# EasyEDA Pro project Project.epro

# Schematic Schematic
Board Name: BOARD; Create Date: 2025-07-29; Page Name: Page 1; Project Name: ICM-20948 Pico; Schematic Name: Schematic; Update Date: 2025-08-12; Company: Astralis; Page Size: A4; Version: v2.5
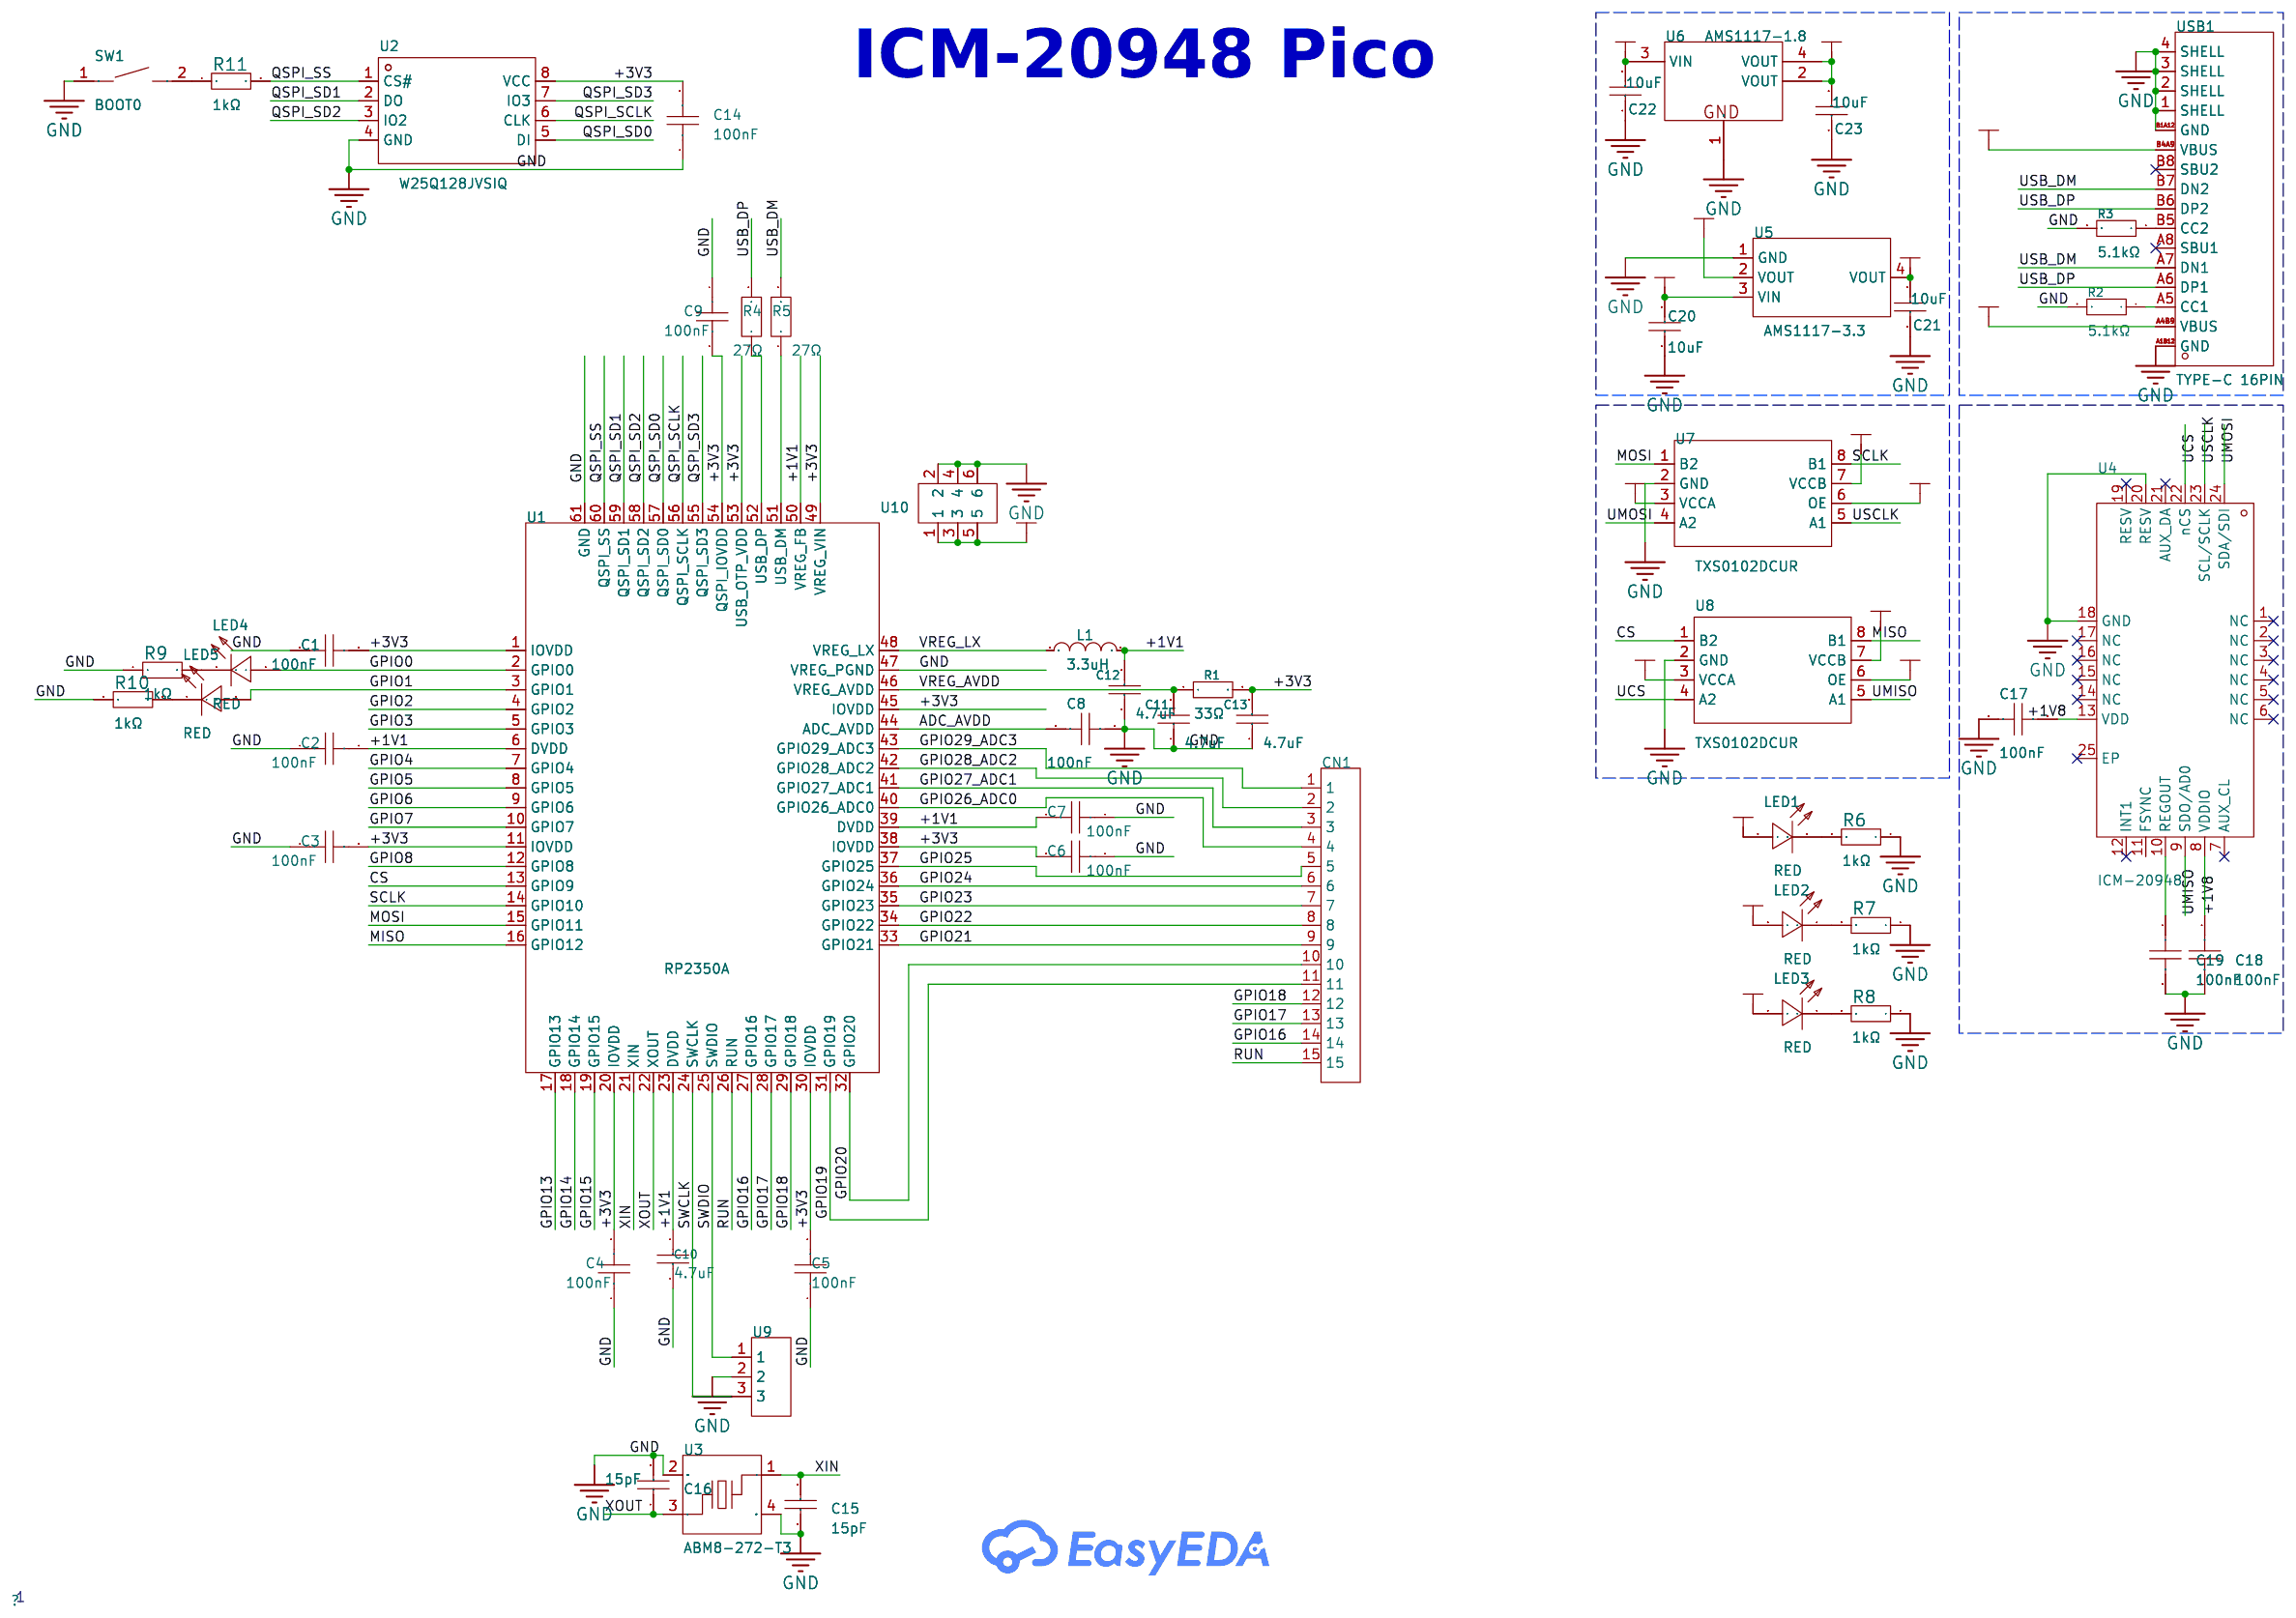
[diagram p0: schematic sheet]

## Parts
C1  100nF  [C0402]
C2  100nF  [C0402]
C3  100nF  [C0402]
C4  100nF  [C0402]
C5  100nF  [C0402]
C6  100nF  [C0402]
C7  100nF  [C0402]
C8  100nF  [C0402]
C9  100nF  [C0402]
C10  4.7uF  [C0402]
C11  4.7uF  [C0402]
C12  4.7uF  [C0402]
C13  4.7uF  [C0402]
C14  100nF  [C0402]
C15  15pF  [C0402]
C16  15pF  [C0402]
C17  100nF  [C0402]
C18  100nF  [C0402]
C19  100nF  [C0402]
C20  10uF  [C0402]
C21  10uF  [C0402]
C22  10uF  [C0402]
C23  10uF  [C0402]
CN1  排母插针1X15P  [CONN-TH_15P-L38.5-W2.4-P2.54]
L1  3.3uH  [IND-SMD_L2.0-W1.6_AOTA-B201610S3R3-101-T]
LED1  RED  [LED0603-RD]
LED2  RED  [LED0603-RD]
LED3  RED  [LED0603-RD]
LED4  RED  [LED0603-RD]
LED5  RED  [LED0603-RD]
R1  33Ω  [R0402]
R2  5.1kΩ  [R0402]
R3  5.1kΩ  [R0402]
R4  27Ω  [R0402]
R5  27Ω  [R0402]
R6  1kΩ  [R0402]
R7  1kΩ  [R0402]
R8  1kΩ  [R0402]
R9  1kΩ  [R0402]
R10  1kΩ  [R0402]
R11  1kΩ  [R0402]
SW1  BOOT0  [SW-SMD_L3.9-W3.0-P4.45]
U1  RP2350A  [QFN-60_L7.0-W7.0-P0.40-TL-EP3.4]
U2  W25Q128JVSIQ  [SOIC-8_L5.3-W5.3-P1.27-LS8.0-BL]
U3  ABM8-272-T3  [CRYSTAL-SMD_4P-L3.2-W2.5-BL]
U4  ICM-20948  [QFN-24_L3.0-W3.0-P0.40-BL-EP]
U5  AMS1117-3.3  [SOT-223-3_L6.5-W3.4-P2.30-LS7.0-BR]
U6  AMS1117-1.8  [SOT-223-4_L6.5-W3.5-P2.30-LS7.0-BR]
U7  TXS0102DCUR  [VSON8_L2.0-W2.3-P0.50-LS3.1-BL]
U8  TXS0102DCUR  [VSON8_L2.0-W2.3-P0.50-LS3.1-BL]
U9  HB-PH3-25413PB2GOP  [HDR-TH_3P-P2.54-V-M]  (no BOM)
U10  ZX-PZ2.54-2-3PZZ  [HDR-TH_6P-P2.54-V-M-R2-C3-S2.54-1]  (no BOM)
USB1  TYPE-C 16PIN  [USB-C-SMD_TYPE-C16PIN]  (no BOM)

## Library data of the parts
C1-C9 C14 C17-C19 = CL05B104KO5NNNC: Capacitance: Tolerance:±10% Tolerance:±10% Voltage Rated: Temperature Coefficient:; LCSC Part Name: 100nF ±10% 16V; Supplier Part: C1525; Manufacturer: SAMSUNG(三星); Supplier Footprint: 0402; Datasheet: https://atta.szlcsc.com/upload/public/pdf/source/20160218/1457707763339.pdf; Supplier: LCSC; Tolerance: ±10%
C10-C13 = CL05A475MP5NRNC: Capacitance: Tolerance:±20% Tolerance:±20% Voltage Rated: Temperature Coefficient:; LCSC Part Name: 4.7uF ±20% 10V; Supplier Part: C23733; Manufacturer: SAMSUNG(三星); Supplier Footprint: 0402; JLCPCB Part Class: Basic Part; Datasheet: https://atta.szlcsc.com/upload/public/pdf/source/20160218/1457707763339.pdf; Supplier: LCSC; Tolerance: ±20%
C15 C16 = 0402CG150J500NT: Capacitance: Tolerance:±5% Tolerance:±5% Voltage Rated: Temperature Coefficient:; LCSC Part Name: 15pF ±5% 50V; Supplier Part: C1548; Manufacturer: FH(风华); Supplier Footprint: 0402; JLCPCB Part Class: Basic Part; Datasheet: https://atta.szlcsc.com/upload/public/pdf/source/20200305/C486355_26A10D38EF8C2A5C37091D0039909270.pdf; Supplier: LCSC; Tolerance: ±5%
C20-C23 = CL05A106MQ5NUNC: Capacitance: Tolerance:±20% Tolerance:±20% Voltage Rated: Temperature Coefficient:; LCSC Part Name: 10uF ±20% 6.3V; Supplier Part: C15525; Manufacturer: SAMSUNG(三星); Supplier Footprint: 0402; JLCPCB Part Class: Basic Part; Datasheet: https://atta.szlcsc.com/upload/public/pdf/source/20220823/2B02EE04F8F211D38A52DCB16EB6BEBA.pdf; Supplier: LCSC; Tolerance: ±20%
CN1 = 排母插针1X15P: Supplier Part: C9900003275; Supplier Footprint: TH-15P; JLCPCB Part Class: Extended Part; Supplier: LCSC
L1 = AOTA-B201610S3R3-101-T: Supplier Part: C42411119; Manufacturer: ABRACON; Supplier Footprint: 0806; JLCPCB Part Class: Extended Part; Datasheet: https://atta.szlcsc.com/upload/public/pdf/source/20241210/8ED7235334351200B2CE75E3CBC0DAAD.pdf; Supplier: LCSC
LED1-LED5 = KT-0603R: Emitted Color:Red Power Dissipation:- Forward Current:- Dominant Wavelength:- Dominant Wavelength:- Peak Wavelength:- Diode Configuration:- Lens Color:- Color Temperature:- Color Temperature:- Viewing Angle:- Mounting Sytle:- Operating Temperature:-40℃~+8; LCSC Part Name: 0603 红灯 高亮; Supplier Part: C2286; Manufacturer: KENTO; Supplier Footprint: 0603; JLCPCB Part Class: Basic Part; Datasheet: https://atta.szlcsc.com/upload/public/pdf/source/20160616/1466072038404.pdf; Supplier: LCSC; Emitted Color: Red; Operating Temperature: -40℃~+85℃
R1 = 0402WGF330JTCE: Type:Thick Film Resistors Resistance:33Ω Tolerance:±1% Tolerance:±1% Power(Watts): Overload Voltage (Max): Temperature Coefficient:±100ppm/℃ Temperature Coefficient:±100ppm/℃ Operating Temperature Range:-55℃~+155℃ Operating Temperature Range:-55℃~+155℃; LCSC Part Name: 33Ω ±1% 62.5mW 厚膜电阻; Supplier Part: C25105; Manufacturer: UNI-ROYAL(厚声); Supplier Footprint: 0402; Datasheet: https://atta.szlcsc.com/upload/public/pdf/source/20200306/C422600_1E6D84923E4A46A82E41ADD87F860B5C.pdf; Supplier: LCSC; Type: Thick Film Resistors; Tolerance: ±1%; Temperature Coefficient: ±100ppm/℃; Operating Temperature Range: -55℃~+155℃
R2 R3 = 0402WGF5101TCE: Type:Thick Film Resistor Resistance:5.1kΩ Tolerance:±1% Tolerance:±1% Power(Watts):62.5mW Voltage-Supply(Max):50V Temperature Coefficient:±100ppm/℃ Temperature Coefficient:±100ppm/℃ Operating Temperature:-55℃~+155℃ Operating Temperature:-55℃~+155℃; LCSC Part Name: 5.1kΩ ±1% 62.5mW 厚膜电阻; Supplier Part: C25905; Manufacturer: UNI-ROYAL(厚声); Supplier Footprint: 0402; JLCPCB Part Class: Basic Part; Datasheet: https://atta.szlcsc.com/upload/public/pdf/source/20200306/C422600_1E6D84923E4A46A82E41ADD87F860B5C.pdf; Supplier: LCSC; Type: Thick Film Resistor; Tolerance: ±1%; Power(Watts): 62.5mW; Voltage-Supply(Max): 50V; Temperature Coefficient: ±100ppm/℃; Operating Temperature: -55℃~+155℃
R4 R5 = WR04X270JTL_C384351: Type:Thick Film Resistor Resistance:27Ω Tolerance:±5% Tolerance:±5% Power(Watts):62.5mW Voltage-Supply(Max):50V Temperature Coefficient:±100ppm/℃ Temperature Coefficient:±100ppm/℃ Operating Temperature:-55℃~+155℃ Operating Temperature:-55℃~+155℃; LCSC Part Name: 厚膜电阻 27Ω ±5% 62.5mW; Supplier Part: C384351; Manufacturer: Walsin(华新科); Manufacturer Part: WR04X270JTL; Supplier Footprint: 0402; JLCPCB Part Class: Extended Part; Datasheet: https://atta.szlcsc.com/upload/public/pdf/source/20191217/C470037_D99261402F77DA8B1D609223749D445A.pdf; Supplier: LCSC; Type: Thick Film Resistor; Tolerance: ±5%; Power(Watts): 62.5mW; Voltage-Supply(Max): 50V; Temperature Coefficient: ±100ppm/℃; Operating Temperature: -55℃~+155℃
R6-R11 = 0402WGF1001TCE: Type:Thick Film Resistors Resistance:1kΩ Tolerance:±1% Tolerance:±1% Power(Watts): Overload Voltage (Max): Temperature Coefficient:±100ppm/℃ Temperature Coefficient:±100ppm/℃ Operating Temperature Range:-55℃~+155℃ Operating Temperature Range:-55℃~+155℃; LCSC Part Name: 1kΩ ±1% 62.5mW 厚膜电阻; Supplier Part: C11702; Manufacturer: UNI-ROYAL(厚声); Supplier Footprint: 0402; JLCPCB Part Class: Basic Part; Datasheet: https://atta.szlcsc.com/upload/public/pdf/source/20200306/C422600_1E6D84923E4A46A82E41ADD87F860B5C.pdf; Supplier: LCSC; Type: Thick Film Resistors; Tolerance: ±1%; Temperature Coefficient: ±100ppm/℃; Operating Temperature Range: -55℃~+155℃
SW1 = TS-1088-AR02016: Circuit:SPST Actuator Style:Round Button Operating Force:160gf Mounting Style:Brick nogging Switch Length:4mm Switch Width:3mm Switch Height:2mm Strike Gundam:不带 Contact Current:50mA Voltage Rating (DC):12V Insulation Resistance:100MΩ Actuator/Cap Color:B; LCSC Part Name: 4*3*2mm 立贴 轻触开关; Supplier Part: C720477; Manufacturer: XUNPU(讯普); Supplier Footprint: SMD; Datasheet: https://atta.szlcsc.com/upload/public/pdf/source/20200810/C720475_60D09DD6C54279ADDB2DC25100F1CC11.pdf; Supplier: LCSC; Circuit: SPST; Actuator Style: Round Button; Operating Force: 160gf; Mounting Style: Brick nogging; Switch Length: 4mm; Switch Width: 3mm; Switch Height: 2mm; Strike Gundam: 不带; Contact Current: 50mA; Voltage Rating (DC): 12V; Insulation Resistance: 100MΩ; Actuator/Cap Color: Black; Pin Style: SMDSplicing; Mechanical Life: 10万次; Operating Temperature: -30℃~+80℃
U1 = RP2350A_C42411118: LCSC Part Name: 微控制器; Supplier Part: C42411118; Manufacturer: Raspberry Pi(树莓派); Supplier Footprint: QFN-60-EP(7x7); JLCPCB Part Class: Extended Part; Datasheet: https://item.szlcsc.com/datasheet/RP2350A/44392931.html; Supplier: LCSC
U2 = W25Q128JVSIQ: Interface Type:SPI Memory Size:128Mbit Clock Frequency (fc):133MHz Supply Voltage:2.7V~3.6V Supply Voltage:2.7V~3.6V Page Programming Time (Tpp):700us Block Erase Time (tBE):120ms@(32KB) Data Retention - TDR (Year):20 years Operating Temperature:-40℃~+85℃; LCSC Part Name: W25Q128JVSIQ 编带; Supplier Part: C97521; Manufacturer: WINBOND(华邦); Supplier Footprint: SOIC-8-208mil; JLCPCB Part Class: Basic Part; Datasheet: https://atta.szlcsc.com/upload/public/pdf/source/20170316/1489627409956.pdf; Supplier: LCSC; Interface Type: SPI; Memory Size: 128Mbit; Clock Frequency (fc): 133MHz; Supply Voltage: 2.7V~3.6V; Page Programming Time (Tpp): 700us; Block Erase Time (tBE): 120ms@(32KB); Data Retention - TDR (Year): 20 years; Operating Temperature: -40℃~+85℃
U3 = ABM8-272-T3_C20625731: Supplier Part: C20625731; Manufacturer: ABRACON; Supplier Footprint: SMD3225-4P; JLCPCB Part Class: Extended Part; Datasheet: https://atta.szlcsc.com/upload/public/pdf/source/20240227/A8BE43F636D80F75C9AF5C59EDF21E9A.pdf; Supplier: LCSC
U4 = ICM-20948: Sensor Type:Accelerometer Gyroscope Operating Temperature:-40℃~+85℃ Operating Temperature:-40℃~+85℃; Supplier Part: C726001; Manufacturer: TDK InvenSense(应美盛); Supplier Footprint: QFN-24(3x3); JLCPCB Part Class: Extended Part; Datasheet: https://atta.szlcsc.com/upload/public/pdf/source/20210715/C726001_EFE09342631EBC06FA98BEAE6CEEEE9D.pdf; Supplier: LCSC; Sensor Type: Accelerometer Gyroscope; Operating Temperature: -40℃~+85℃
U5 = AMS1117-3.3_C6186: Output Type:Fixed Voltage - Supply:16V Output Voltage:3.3V Output Voltage:3.3V Output Current:1A Power Supply Rejection Ratio (PSRR):72dB@(120Hz) Voltage Dropout:1.1V@(800mA) standby current:5mA Noise:- Features:Over Current Protection；Over Temperature Pr; LCSC Part Name: 输出3.3V 1A; Supplier Part: C6186; Manufacturer: AMS; Supplier Footprint: SOT-223; Datasheet: https://item.szlcsc.com/datasheet/AMS1117-3.3/6652.html; Supplier: LCSC; Output Type: Fixed; Voltage - Supply: 16V; Output Voltage: 3.3V; Output Current: 1A; Power Supply Rejection Ratio (PSRR): 72dB@(120Hz); Voltage Dropout: 1.1V@(800mA); standby current: 5mA; Features: Over Current Protection；Over Temperature Protection; Operating Temperature: -40℃~+125℃; Output Configuration: Positive; Number of Outputs: 1
U6 = AMS1117-1.8: Output Type:Fixed Voltage - Supply:12V Output Voltage:1.8V Output Voltage:1.8V Output Current:1A Power Supply Rejection Ratio (PSRR):70dB@(120Hz) Voltage Dropout:1.4V@(1A) standby current:10mA Noise:- Features:Thermal Shutdown；Over Temperature Protection; LCSC Part Name: 输入18V 输出1.8V 1A; Supplier Part: C351432; Manufacturer: PUOLOP(迪浦); Supplier Footprint: SOT-223-4; JLCPCB Part Class: Extended Part; Datasheet: https://atta.szlcsc.com/upload/public/pdf/source/20240730/7181C1A6BD6A2E87EB4FF6312646ECA7.pdf; Supplier: LCSC; Output Type: Fixed; Voltage - Supply: 12V; Output Voltage: 1.8V; Output Current: 1A; Power Supply Rejection Ratio (PSRR): 70dB@(120Hz); Voltage Dropout: 1.4V@(1A); standby current: 10mA; Features: Thermal Shutdown；Over Temperature Protection; Operating Temperature: -40℃~+125℃@(Tj); Output Configuration: Positive; Number of Outputs: 1
U7 U8 = TXS0102DCUR: Channel Type:Bidirectional Input Signal:- Output Signal:- Data Rate:24Mbps Supply Voltage (VCCA):1.65V~3.6V Supply Voltage (VCCA):1.65V~3.6V Supply Voltage (VCCB):2.3V~5.5V Supply Voltage (VCCB):2.3V~5.5V Number of Circuits:1 Channels per Circuit:2 Output; LCSC Part Name: 24Mbps 2位双向电平转换器; Supplier Part: C53434; Manufacturer: TI(德州仪器); Supplier Footprint: VSSOP-8; JLCPCB Part Class: Extended Part; Datasheet: https://www.ti.com/cn/lit/gpn/txs0102; Supplier: LCSC; Channel Type: Bidirectional; Data Rate: 24Mbps; Supply Voltage (VCCA): 1.65V~3.6V; Supply Voltage (VCCB): 2.3V~5.5V; Number of Circuits: 1; Channels per Circuit: 2; Output Type: Open circuit leakage；Push-pull type; Operating Temperature: -40℃~+85℃; Features: Automatic Direction Detection; Voltage - Supply(VCCA): 1.65V~3.6V; Voltage - Supply(VCCB): 2.3V~5.5V
U9 = HB-PH3-25413PB2GOP: Pin Structure:1x3P Pitch:2.54mm Row Spacing:2.54mm Circluar Pins/Square Pins:Policy Mounting Type:Straight Number of Rows:Single Row Number of Pins:3P Current Rating:3A Voltage Rating (Max):250V Length of Mating Pin:6mm Insulation Height:2.54mm Length of; LCSC Part Name: 1x3P 间距:2.54mm 方针 直插; Supplier Part: C6332196; Manufacturer: HANBO(汉博); Supplier Footprint: 插件,P=2.54mm; Datasheet: https://atta.szlcsc.com/upload/public/pdf/source/20230803/F72D259687963761DF1B552F3BB84A31.pdf; Supplier: LCSC; Pin Structure: 1x3P; Pitch: 2.54mm; Row Spacing: 2.54mm; Circluar Pins/Square Pins: Policy; Mounting Type: Straight; Number of Rows: Single Row; Number of Pins: 3P; Current Rating: 3A; Voltage Rating (Max): 250V; Length of Mating Pin: 6mm; Insulation Height: 2.54mm; Length of End Connection Pin: 3mm; Contact Material: Brass; Contact Plating: Gold; Operating Temperature: -40℃~+105℃; Color: Black
U10 = ZX-PZ2.54-2-3PZZ: Pin Structure:2x3P Pitch:2.54mm Row Spacing:2.54mm Circluar Pins/Square Pins:Policy Mounting Type:Straight Number of Rows:Double Row Number of Pins:6P Current Rating:3A Voltage Rating (Max):1kV Length of Mating Pin:6mm Insulation Height:2.5mm Length of En; LCSC Part Name: 2x3P 间距:2.54mm 方针 直插; Supplier Part: C7501274; Manufacturer: Megastar(兆星); Supplier Footprint: 插件,P=2.54mm; JLCPCB Part Class: Extended Part; Datasheet: https://atta.szlcsc.com/upload/public/pdf/source/20231122/E8390501A702A71E626C593F036B3607.pdf; Supplier: LCSC; Pin Structure: 2x3P; Pitch: 2.54mm; Row Spacing: 2.54mm; Circluar Pins/Square Pins: Policy; Mounting Type: Straight; Number of Rows: Double Row; Number of Pins: 6P; Current Rating: 3A; Voltage Rating (Max): 1kV; Length of Mating Pin: 6mm; Insulation Height: 2.5mm; Length of End Connection Pin: 3mm; Contact Material: Brass; Contact Plating: Gold; Operating Temperature: -40℃~+105℃; Color: Black
USB1 = TYPE-C16PIN: Connector Type:Type-C Protocol Standard:USB 3.1 Gender:Female Mounting Type:Surface Mount, Right Angle Number of Contacts:16P Number of Ports:1 Current Rating-Power:3A Voltage Rating:30V Connect-Disconnect Life:10,000 Cycles Detection color:Black Operatin; LCSC Part Name: Type-C 母 卧贴; Supplier Part: C393939; Manufacturer: SHOU HAN(首韩); Supplier Footprint: SMD; JLCPCB Part Class: Extended Part; Datasheet: https://atta.szlcsc.com/upload/public/pdf/source/20250618/9FBF2A26CFCE0E69298FA0B726710E9E.pdf; Supplier: LCSC; Connector Type: Type-C; Protocol Standard: USB 3.1; Gender: Female; Mounting Type: Surface Mount, Right Angle; Number of Contacts: 16P; Number of Ports: 1; Current Rating-Power: 3A; Voltage Rating: 30V; Connect-Disconnect Life: 10,000 Cycles; Detection color: Black; Operating Temperature: -40℃~+85℃

## Nets
+1V1: C2.2 C7.2 C10.2 C12.2 L1.2 U1.6(DVDD) U1.23(DVDD) U1.39(DVDD) U1.50(VREG_FB)
+1V8: C17.2 C18.1 C23.2 LED3.2(A) U4.8(VDDIO) U4.13(VDD) U6.2(VOUT) U6.4(VOUT) U7.3(VCCA) U7.6(OE) U8.3(VCCA) U8.6(OE)
+3V3: C1.2 C3.2 C4.2 C5.2 C6.2 C9.2 C13.2 C14.2 C21.2 LED2.2(A) R1.2 U1.1(IOVDD) U1.11(IOVDD) U1.20(IOVDD) U1.30(IOVDD) U1.38(IOVDD) U1.45(IOVDD) U1.49(VREG_VIN) U1.53(USB_OTP_VDD) U1.54(QSPI_IOVDD) U2.8(VCC) U5.2(VOUT) U5.4(VOUT) U7.7(VCCB) U8.7(VCCB) U10.1 U10.3 U10.5
GND: C1.1 C2.1 C3.1 C4.1 C5.1 C6.1 C7.1 C8.1 C9.1 C10.1 C11.1 C12.1 C13.1 C14.1 C15.1 C16.2 C17.1 C18.2 C19.2 C20.1 C21.1 C22.1 C23.1 R2.2 R3.2 R6.1 R7.1 R8.1 R9.1 R10.1 SW1.1 U1.47(VREG_PGND) U1.61(GND) U2.4(GND) U3.2(GND) U3.4(GND) U4.18(GND) U4.20(RESV) U5.1(GND) U6.1(GND) U7.2(GND) U8.2(GND) U9.2 U10.2 U10.4 U10.6 USB1.1(SHELL) USB1.2(SHELL) USB1.3(SHELL) USB1.4(SHELL) USB1.A1B12(GND) USB1.B1A12(GND)
VBUS: C20.2 C22.2 LED1.2(A) U5.3(VIN) U6.3(VIN) USB1.A4B9(VBUS) USB1.B4A9(VBUS)
ADC_AVDD: C8.2 U1.44(ADC_AVDD)
CS: U1.13(GPIO9) U8.1(B2)
GPIO0: LED4.2(A) U1.2(GPIO0)
GPIO1: LED5.2(A) U1.3(GPIO1)
GPIO2: U1.4(GPIO2)
GPIO3: U1.5(GPIO3)
GPIO4: U1.7(GPIO4)
GPIO5: U1.8(GPIO5)
GPIO6: U1.9(GPIO6)
GPIO7: U1.10(GPIO7)
GPIO8: U1.12(GPIO8)
GPIO13: U1.17(GPIO13)
GPIO14: U1.18(GPIO14)
GPIO15: U1.19(GPIO15)
GPIO16: CN1.14 U1.27(GPIO16)
GPIO17: CN1.13 U1.28(GPIO17)
GPIO18: CN1.12 U1.29(GPIO18)
GPIO19: CN1.11 U1.31(GPIO19)
GPIO20: CN1.10 U1.32(GPIO20)
GPIO21: CN1.9 U1.33(GPIO21)
GPIO22: CN1.8 U1.34(GPIO22)
GPIO23: CN1.7 U1.35(GPIO23)
GPIO24: CN1.6 U1.36(GPIO24)
GPIO25: CN1.5 U1.37(GPIO25)
GPIO26_ADC0: CN1.4 U1.40(GPIO26_ADC0)
GPIO27_ADC1: CN1.3 U1.41(GPIO27_ADC1)
GPIO28_ADC2: CN1.2 U1.42(GPIO28_ADC2)
GPIO29_ADC3: CN1.1 U1.43(GPIO29_ADC3)
MISO: U1.16(GPIO12) U8.8(B1)
MOSI: U1.15(GPIO11) U7.1(B2)
QSPI_SCLK: U1.56(QSPI_SCLK) U2.6(CLK)
QSPI_SD0: U1.57(QSPI_SD0) U2.5(DI)
QSPI_SD1: U1.59(QSPI_SD1) U2.2(DO)
QSPI_SD2: U1.58(QSPI_SD2) U2.3(IO2)
QSPI_SD3: U1.55(QSPI_SD3) U2.7(IO3)
QSPI_SS: R11.2 U1.60(QSPI_SS) U2.1(CS#)
RUN: CN1.15 U1.26(RUN)
SCLK: U1.14(GPIO10) U7.8(B1)
SWCLK: U1.24(SWCLK) U9.3
SWDIO: U1.25(SWDIO) U9.1
UCS: U4.22(nCS) U8.4(A2)
UMISO: U4.9(SDO/AD0) U8.5(A1)
UMOSI: U4.24(SDA/SDI) U7.4(A2)
USB_DM: R5.2 USB1.A7(DN1) USB1.B7(DN2)
USB_DP: R4.2 USB1.A6(DP1) USB1.B6(DP2)
USCLK: U4.23(SCL/SCLK) U7.5(A1)
VREG_AVDD: C11.2 R1.1 U1.46(VREG_AVDD)
VREG_LX: L1.1 U1.48(VREG_LX)
XIN: C15.2 U1.21(XIN) U3.1
XOUT: C16.1 U1.22(XOUT) U3.3
$1N10163: R5.1 U1.51(USB_DM)
$1N10164: R4.1 U1.52(USB_DP)
$1N10214: R2.1 USB1.A5(CC1)
$1N10215: R3.1 USB1.B5(CC2)
$1N10260: C19.1 U4.10(REGOUT)
$1N10297: LED1.1(K) R6.2
$1N10303: LED2.1(K) R7.2
$1N10309: LED3.1(K) R8.2
$1N12330: LED4.1(K) R9.2
$1N12589: LED5.1(K) R10.2
$1N12752: R11.1 SW1.2

Not connected (* = marked no-connect by the designer): U4 1(NC)* 2(NC)* 3(NC)* 4(NC)* 5(NC)* 6(NC)* 7(AUX_CL)* 11(FSYNC) 12(INT1)* 14(NC)* 15(NC)* 16(NC)* 17(NC)* 19(RESV)* 21(AUX_DA)* 25(EP)*; USB1 A8(SBU1)* B8(SBU2)*

## Notes on the sheet
- ICM-20948 Pico

# Board PCB
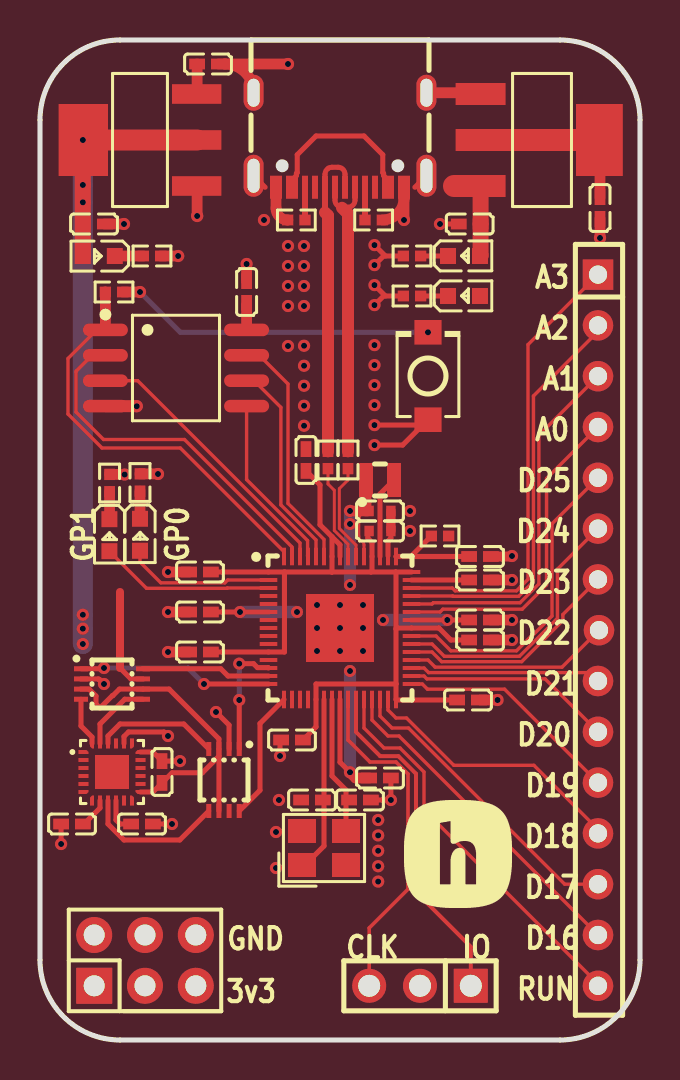
[diagram p1: board, top side]
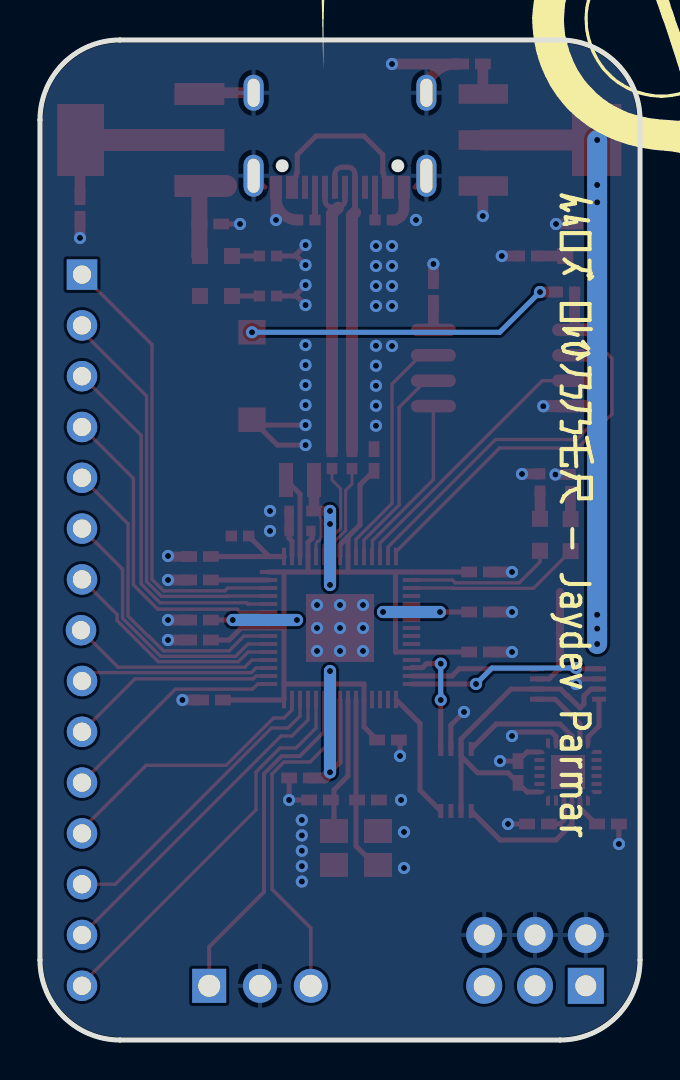
[diagram p2: board, bottom side, seen from below]

Outline 30 x 50 mm; copper layers: Top Layer, Bottom Layer. Coordinates in mm from the lower left corner of the outline.
Outline path: 0,46 0,4 arc(1.17,1.17) 4,0 26,0 arc(28.83,1.17) 30,4 30,46 arc(28.83,48.83) 26,50 4,50 arc(1.17,48.83) 0,46
Stack: Top Layer 0.035mm / Dielectric1 1.51mm FR4 er 4.5 / Bottom Layer 0.035mm

## Design rules (mm)
template: Custom Config
spacing copperThickness1oz (default): track to track 0.102, other pairs 0.152 to 0.3
spacing copperThickness2oz: track to track 0.203, other pairs 0.152 to 0.3
track width copperThickness1oz (default): min 0.127, default 0.254, max 2.54
track width copperThickness2oz: min 0.203, default 0.254, max 2.54
differential pair differentialPair (default): width min 0.127, default 0.254, max 2.54; gap min 0.152, default 0.152
via viaSize (default): diameter min 0.5, default 0.61, max 10; hole min 0.3, default 0.305, max 6.3

## Placement (name value [footprint] x y rotation side)
C1  100nF  [C0402#2]  8 23.4 0 top
C2  100nF  [C0402#2]  8 21.4 0 top
C3  100nF  [C0402#2]  8 19.4 0 top
C4  100nF  [C0402#2]  12.6 15 0 top
C5  100nF  [C0402#2]  21.4 17 180 top
C6  100nF  [C0402#2]  22 20 180 top
C7  100nF  [C0402#2]  22 21 180 top
C8  100nF  [C0402#2]  22 23 180 top
C9  100nF  [C0402#2]  13.3 29 270 top
C10  4.7uF  [C0402#2]  17 13.1 180 top
C11  4.7uF  [C0402#2]  22 24.17 180 top
C12  4.7uF  [C0402]  17 26.45 180 top
C13  4.7uF  [C0402]  17 25.45 180 top
C14  100nF  [C0402#2]  10.33 37.4 270 top
C15  15pF  [C0402#2]  13.6 12 0 top
C16  15pF  [C0402#2]  16 12 0 top
C17  100nF  [C0402#2]  6.1 13.4 270 top
C18  100nF  [C0402#2]  1.6 10.8 180 top
C19  100nF  [C0402#2]  5.1 10.8 0 top
C20  10uF  [C0402#2]  21.49 40.8 0 top
C21  10uF  [C0402#2]  28 41.6 90 top
C22  10uF  [C0402#2]  8.4 48.8 180 top
C23  10uF  [C0402#2]  2.7 40.8 180 top
CN1  排母插针1X15P  [CONN-TH_15P-L38.5-W2.4-P2.54]  27.93 20.49 270 top
L1  3.3uH  [IND-SMD_L2.0-W1.6_AOTA-B201610S3R3-101-T]  17 28 180 top
LED1  RED  [LED0603-RD]  21.2 39.2 0 top
LED2  RED  [LED0603-RD]  21.2 37.2 0 top
LED3  RED  [LED0603-RD]  2.94 39.2 180 top
LED4  RED  [LED0603-RD]  5 25.26 270 top
LED5  RED  [LED0603-RD]  3.47 25.24 270 top
R1  33Ω  [R0402]  20 25.2 0 top
R2  5.1kΩ  [R0402]  16.68 41 0 top
R3  5.1kΩ  [R0402]  12.82 41 180 top
R4  27Ω  [R0402]  14.4 29 90 top
R5  27Ω  [R0402]  15.4 29 90 top
R6  1kΩ  [R0402]  18.6 39.2 0 top
R7  1kΩ  [R0402]  18.6 37.2 0 top
R8  1kΩ  [R0402]  5.6 39.2 180 top
R9  1kΩ  [R0402]  5 27.88 270 top
R10  1kΩ  [R0402]  3.48 27.85 270 top
R11  1kΩ  [R0402]  3.7 37.4 180 top
SW1  BOOT0  [SW-SMD_L3.9-W3.0-P4.45]  19.4 33.2 90 top
U1  RP2350A  [QFN-60_L7.0-W7.0-P0.40-TL-EP3.4]  15 20.6 0 top
U2  W25Q128JVSIQ  [SOIC-8_L5.3-W5.3-P1.27-LS8.0-BL]  6.8 33.6 270 top
U3  ABM8-272-T3  [CRYSTAL-SMD_4P-L3.2-W2.5-BL]  14.2 9.6 0 top
U4  ICM-20948  [QFN-24_L3.0-W3.0-P0.40-BL-EP]  3.6 13.4 270 top
U5  AMS1117-3.3  [SOT-223-3_L6.5-W3.4-P2.30-LS7.0-BR]  25 45 180 top
U6  AMS1117-1.8  [SOT-223-4_L6.5-W3.5-P2.30-LS7.0-BR]  5 45 0 top
U7  TXS0102DCUR  [VSON8_L2.0-W2.3-P0.50-LS3.1-BL]  3.6 17.8 270 top
U8  TXS0102DCUR  [VSON8_L2.0-W2.3-P0.50-LS3.1-BL]  9.2 13 180 top
U9  HB-PH3-25413PB2GOP  [HDR-TH_3P-P2.54-V-M]  19 2.71 180 top
U10  ZX-PZ2.54-2-3PZZ  [HDR-TH_6P-P2.54-V-M-R2-C3-S2.54-1]  5.25 3.98 0 top
USB1  TYPE-C 16PIN  [USB-C-SMD_TYPE-C16PIN]  15 45 180 top

## Footprints (pads in the part's own frame, mm; a bottom-side part is the same pattern mirrored in y, then rotated)
C0402
  rect 0.47x0.53 smd: 1(-0.545,0) 2(0.545,0)
C0402#2
  rect 0.79x0.54 smd: 1(-0.545,0) 2(0.545,0)
CONN-TH_15P-L38.5-W2.4-P2.54
  rect 1.524x1.524 hole 0.914: 1(-17.78,-0.025)
  round 1.524 hole 0.914: 2(-15.24,-0.025) 3(-12.7,-0.025) 4(-10.16,-0.025) 5(-7.62,-0.025) 6(-5.08,-0.025) 7(-2.54,-0.025) 8(0,0.025) 9(2.54,-0.025) 10(5.08,-0.025) 11(7.62,-0.025) 12(10.16,-0.025) 13(12.7,-0.025) 14(15.24,-0.025) 15(17.78,-0.025)
CRYSTAL-SMD_4P-L3.2-W2.5-BL
  rect 1.4x1.2 smd: 1(-1.1,-0.85) 2(1.1,-0.85) 3(1.1,0.85) 4(-1.1,0.85)
HDR-TH_3P-P2.54-V-M
  rect 1.7x1.7 hole 1.1: 1(-2.54,0)
  round 1.7 hole 1.1: 2(0,0) 3(2.54,0)
HDR-TH_6P-P2.54-V-M-R2-C3-S2.54-1
  rect 1.8x1.8 hole 1.05: 1(-2.54,-1.27)
  round 1.8 hole 1.05: 2(-2.54,1.27) 3(0,-1.27) 4(0,1.27) 5(2.54,-1.27) 6(2.54,1.27)
IND-SMD_L2.0-W1.6_AOTA-B201610S3R3-101-T
  rect 0.7x1.7 smd: 1(-0.7,0) 2(0.7,0)
LED0603-RD
  rect 0.8x0.8 smd: 1(-0.799,0) 2(0.799,0)
QFN-24_L3.0-W3.0-P0.40-BL-EP
  custom 0.2x0.506 smd: 1(-1,-1.427) 6(1,-1.427) 13(1,1.427) 18(-1,1.427)
  rect 0.2x0.505 smd: 2(-0.6,-1.427) 3(-0.2,-1.427) 4(0.2,-1.427) 5(0.6,-1.427) 14(0.6,1.427) 15(0.2,1.427) 16(-0.2,1.427) 17(-0.6,1.427)
  custom 0.506x0.2 smd: 7(1.427,-1) 12(1.427,1) 19(-1.427,1) 24(-1.427,-1)
  rect 0.505x0.2 smd: 8(1.427,-0.6) 9(1.427,-0.2) 10(1.427,0.2) 11(1.427,0.6) 20(-1.427,0.6) 21(-1.427,0.2) 22(-1.427,-0.2) 23(-1.427,-0.6)
  rect 1.7x1.7 smd: 25(0,0)
QFN-60_L7.0-W7.0-P0.40-TL-EP3.4
  rect 0.875x0.2 smd: 1(-3.575,2.8) 2(-3.575,2.4) 3(-3.575,2) 4(-3.575,1.6) 5(-3.575,1.2) 6(-3.575,0.8) 7(-3.575,0.4) 8(-3.575,0) 9(-3.575,-0.4) 10(-3.575,-0.8) 11(-3.575,-1.2) 12(-3.575,-1.6) 13(-3.575,-2) 14(-3.575,-2.4) 15(-3.575,-2.8) 31(3.575,-2.8) 32(3.575,-2.4) 33(3.575,-2.001) 34(3.575,-1.6) 35(3.575,-1.2) 36(3.575,-0.8) 37(3.575,-0.4) 38(3.575,-0.001) 39(3.575,0.4) 40(3.575,0.8) 41(3.575,1.2) 42(3.575,1.6) 43(3.575,2) 44(3.575,2.4) 45(3.575,2.8)
  rect 0.2x0.875 smd: 16(-2.8,-3.575) 17(-2.4,-3.575) 18(-2,-3.575) 19(-1.6,-3.575) 20(-1.2,-3.575) 21(-0.8,-3.575) 22(-0.4,-3.575) 23(0,-3.575) 24(0.4,-3.575) 25(0.8,-3.575) 26(1.2,-3.575) 27(1.6,-3.575) 28(2,-3.575) 29(2.4,-3.575) 30(2.8,-3.575) 46(2.8,3.575) 47(2.4,3.575) 48(2,3.575) 49(1.6,3.575) 50(1.2,3.575) 51(0.8,3.575) 52(0.4,3.575) 53(0,3.575) 54(-0.4,3.575) 55(-0.8,3.575) 56(-1.2,3.575) 57(-1.6,3.575) 58(-2,3.575) 59(-2.4,3.575) 60(-2.8,3.575)
  rect 3.4x3.4 smd: 61(0,0)
R0402
  rect 0.566x0.54 smd: 1(-0.433,0) 2(0.433,0)
SOIC-8_L5.3-W5.3-P1.27-LS8.0-BL
  oval 0.63x2.25 smd: 1(-1.905,-3.53) 2(-0.635,-3.53) 3(0.635,-3.53) 4(1.905,-3.53) 5(1.905,3.53) 6(0.635,3.53) 7(-0.635,3.53) 8(-1.905,3.53)
SOT-223-3_L6.5-W3.4-P2.30-LS7.0-BR
  rect 2.5x1.1 smd: 1(2.97,-2.3) 2(2.97,0) 3(2.97,2.3)
  rect 2.34x3.6 smd: 4(-2.97,0)
SOT-223-4_L6.5-W3.5-P2.30-LS7.0-BR
  rect 2.47x0.98 smd: 1(2.835,-2.3) 2(2.835,0) 3(2.835,2.3)
  rect 2.47x3.6 smd: 4(-2.835,0)
SW-SMD_L3.9-W3.0-P4.45
  rect 1.23x1.36 smd: 1(-2.185,0) 2(2.185,0)
USB-C-SMD_TYPE-C16PIN
  oval 1x2.1 hole 0.6x1.7: 1(-4.32,1.788) 2(4.32,1.788)
  oval 1x1.8 hole 0.6x1.4: 3(-4.32,-2.362) 4(4.32,-2.362)
  rect 0.6x1.15 smd: A1B12(-3.2,2.362) A4B9(-2.4,2.362) B1A12(3.2,2.362) B4A9(2.4,2.362)
  rect 0.3x1.15 smd: A5(-1.25,2.362) A6(-0.25,2.362) A7(0.25,2.362) A8(1.25,2.362) B5(1.75,2.362) B6(0.75,2.362) B7(-0.75,2.362) B8(-1.75,2.362)
VSON8_L2.0-W2.3-P0.50-LS3.1-BL
  rect 0.25x0.7 smd: 1(-0.762,-1.55) 2(-0.254,-1.55) 3(0.254,-1.55) 4(0.762,-1.55) 5(0.762,1.55) 6(0.254,1.55) 7(-0.254,1.55) 8(-0.762,1.55)

## Nets
As in the schematic.

Pads without a net: U4 1 2 3 4 5 6 7 11 12 14 15 16 17 19 21 25; USB1 A8 B8

## Via types
v1: diameter 0.61, hole 0.305, Top Layer to Bottom Layer, 86 vias
v2: diameter 0.6, hole 0.305, Top Layer to Bottom Layer, 6 vias

## Routing (per net, layer and track width the routed paths; a pad name or vN(x,y) marks a point on that pad's centre or on a via; arc(x,y) is an arc through that point)
+1V1: length 30.5
  Top Layer w0.15: U1.50 16.2,24.75 arc(16.18,24.84) 16.13,24.92 arc(15.99,25.02) 15.94,25.19 15.94,26 arc(16.07,26.32) 16.39,26.45
  Top Layer w0.254: C7.2 v2(20.36,21) U1.39 ; U1.23 15,13.89 v1(15.5,13.39) ; C2.2 v2(10,21.4) U1.6
  Top Layer w0.53: 16.39,26.45 v1(15.5,26.45)
  Top Layer w0.54: v1(15.5,13.39) 15.79,13.1 C10.2 ; L1.2 16.3,26.54
  Bottom Layer w0.61: v2(12.85,21.4) v2(10,21.4) ; v2(17.15,21) v2(20.36,21) ; v1(15.5,26.45) v1(15.5,25.8) v2(15.5,22.75) ; v2(15.5,18.45) v1(15.5,13.39)
+1V8: length 55.5
  Top Layer w0.254: C18.1 2.2,10.8 3,11.6 U4.8 ; U8.6 8.95,14.19 ; 8.95,14.19 8.12,13.36 6.61,13.36 C17.2 5.65,12.4 U4.13 ; 8.95,14.19 U8.3 8.95,15.05 6.45,17.55 U7.6 3.97,17.55 3.64,17.22 3.62,17.22 3,16.6 2.8,16.8 2.8,17.2 2.45,17.55 U7.3
  Top Layer w0.8: 2.14,45 LED3.2
  Top Layer w1.05: 7.86,45 v1(2.14,45)
  Bottom Layer w1: v1(2.14,45) v1(2.14,42.75) v1(2.14,41.88) v1(2.14,21.26) v1(2.14,20.57) v1(2.14,19.8)
+3V3: length 62.4
  Top Layer w0.254: C1.2 U1.1 12.22,23.4 ; 14.6,25.16 14,25.76 14,27.75 C9.2 ; 14.6,25.16 U1.54 14.6,23.4 14.6,23.4 ; 14.6,25.16 15,24.76 U1.53 ; C3.2 U1.11 12.22,19.4 12.22,23.4 ; C5.2 17.82,17 U1.30 17.8,17.79 arc(17.8,17.8) 17.79,17.8 ; 17.79,17.8 13.8,17.8 U1.20 13.8,15.65 C4.2 ; 17.79,17.8 arc(17.8,17.8) 17.8,17.81 17.8,20.55 ; 16.55,23.4 14.6,23.4 ; 16.55,23.4 17.79,23.4 ; 16.55,23.4 arc(16.59,23.41) 16.6,23.45 U1.49 16.6,24.88 16.39,25.09 16.39,25.39 C13.2 ; 14.6,23.4 12.22,23.4 ; C6.2 20.55,20 19.95,20.6 U1.38 17.85,20.6 arc(17.81,20.59) 17.8,20.55 ; 17.8,20.55 17.8,23.39 arc(17.8,23.4) 17.79,23.4 ; 4,18.6 4.55,18.05 U7.7 ; 17.79,23.4 U1.45
  Top Layer w0.4: 4,18.6 4,22.4
  Top Layer w0.54: U2.8 10.33,36.78 ; U5.4 28,44.97 C21.2
  Top Layer w1.1: U5.2 U5.4
GND: length 58.6
  Top Layer w0.254: v1(16.72,29.75) 18.13,29.75 19.13,30.75 ; v1(6.4,15.2) 6.2,15.4 4.43,15.4 4.2,15.17 U4.20 ; R6.1 17.27,39.2 v1(16.72,39.75) ; R7.1 17.27,37.2 v1(16.72,37.75) ; 11.25,42.64 USB1.2 ; C19.2 v1(6.6,10.8) ; v1(8.8,16.4) 9.45,15.75 U8.2 ; 18.75,42.64 USB1.1 ; 17.18,39.2 v1(16.72,38.75) ; C20.1 v1(20,40.8) ; U4.18 5.65,14.4 C17.1 v1(7,13.94) ; 19.13,30.75 v1(16.72,30.75) ; 19.13,30.75 SW1.1 ; C10.1 v1(17.55,12) C16.2 ; C13.1 17.55,25.09 17.4,24.95 17.4,24.22 ; 17.18,37.2 v1(16.72,36.75) ; U7.2 2.92,18.05 2.96,18.02 2.98,18.02 v1(3.2,17.8) ; C18.2 v1(1.06,9.8) ; v1(12,14.2) 12,14.94 C4.1
  Top Layer w0.47: C13.1 C12.1
  Top Layer w0.5: C11.1 23.57,24.17 v1(23.6,24.2)
  Top Layer w0.54: v1(4.2,40.8) 3.23,40.8 ; v1(6.91,39.2) R8.1 ; R10.1 4.22,28.28 v1(4.23,28.27) ; USB1.A1B12 18.2,42.08 arc(18.2,42.08) 18.2,42.07 ; C8.1 v1(23.6,23) ; C1.1 v1(6.4,23.4) ; C14.1 v1(10.33,38.8) ; v1(5.9,28.3) 5.89,28.31 R9.1 ; 8.95,48.8 9.24,48.8 ; 9.24,48.8 v1(12.4,48.8) ; 9.24,48.8 arc(10.26,48.38) USB1.4 ; C2.1 v1(6.4,21.4) ; U5.1 21.97,47.36 USB1.3 ; C21.1 v1(28,40.1) ; C3.1 v1(6.4,19.4) ; v1(18.2,41) 18.2,42.07 ; 18.2,42.07 arc(17.88,41.31) 17.12,41 ; 7.86,42.7 v1(7.86,41.2) ; USB1.B1A12 11.8,41.58 arc(11.97,41.17) 12.38,41 arc(12.38,41) R3.2 ; v1(23.6,20) C6.1 ; v1(23.6,21) C7.1 ; v1(22.88,17) 22.02,17
  Top Layer w0.6: 4.83,31.69 U2.4
  vias: v1(4.84,31.69) v1(11.2,41) v1(11.8,10.4) v1(11.8,8.6) v1(11.95,12) v1(12.4,39.7) v1(12.4,38.7) v1(12.4,37.7) v1(12.4,36.7) v1(12.4,34.7) v1(13.2,39.7) v1(13.2,38.7) v1(13.2,37.7) v1(13.2,36.7) v1(13.2,34.71) v1(13.2,33.71) v1(13.2,32.71) v1(13.2,31.71) v1(13.2,30.71) v1(13.85,21.75) v1(13.85,20.6) v1(13.85,19.45) v1(15,21.75) v1(15,20.6) v1(15,19.45) v1(16.15,21.75) v1(16.15,20.6) v1(16.15,19.45) v1(16.72,34.75) v1(16.72,33.75) v1(16.72,32.75) v1(16.72,31.75) v1(16.91,11) v1(16.91,10.23) v1(16.91,9.46) v1(16.91,8.69) v1(16.91,7.92) v1(18.5,26.45) v1(18.5,25.45)
VBUS: length 14.9
  Top Layer w0.254: USB1.A4B9 17.4,43 17.18,43.22 17.18,43.33 17.14,43.37 17.14,44.26 16.2,45.2 13.8,45.2 12.86,44.26 12.86,43.37 12.82,43.33 12.82,43.22 12.6,43 USB1.B4A9
  Top Layer w0.54: 7.86,47.3 7.86,48.8
  Top Layer w0.8: U5.3 C20.2 22.03,39.23 LED1.2
  Top Layer w1.1: U5.3 20.7,42.7
ADC_AVDD: length 2.9
  Top Layer w0.254: C8.2 U1.44
CS: length 5.9
  Top Layer w0.254: 9.9,18.82 10.68,18.82 10.87,18.62 11.4,18.62 U1.13 ; U8.1 v1(9.96,17)
  Bottom Layer w0.254: v1(9.96,17) v1(9.96,18.82)
GPIO0: length 7.5
  Top Layer w0.17: 5,24.46 5,23.9 6.04,22.86 9.24,22.86 9.38,23 U1.2
GPIO1: length 8.7
  Top Layer w0.17: 3.47,24.44 5.32,22.59 9.35,22.59 9.37,22.6 U1.3
GPIO16: length 16.8
  Top Layer w0.17: CN1.14 17.95,15.2 17.4,15.2 16.6,16 U1.27
GPIO17: length 15.2
  Top Layer w0.17: U1.28 17,16.2 17.6,15.6 18.43,15.6 26.24,7.79 CN1.13
GPIO18: length 13.7
  Top Layer w0.17: U1.29 17.4,16.5 17.8,16.1 18.33,16.1 20.69,13.73 24.69,13.73 27.9,10.53 CN1.12
GPIO19: length 11.4
  Top Layer w0.17: U1.31 19.12,17.8 19.37,17.54 23.23,17.54 CN1.11
GPIO20: length 10.5
  Top Layer w0.17: U1.32 19.2,18.2 19.34,18.06 25.25,18.06 CN1.10
GPIO21: length 9.6
  Top Layer w0.17: CN1.9 27.48,18.37 19.43,18.37 19.2,18.6 U1.33
GPIO22: length 10.3
  Top Layer w0.17: U1.34 19.4,19 19.76,18.64 26.1,18.64 27.95,20.49
GPIO23: length 11.4
  Top Layer w0.17: CN1.7 26.14,21.27 26.14,20.97 24.08,18.91 20.09,18.91 19.6,19.4 U1.35
GPIO24: length 13.7
  Top Layer w0.17: U1.36 19.6,19.8 20.21,19.19 23.97,19.19 25.87,21.09 25.87,23.54 CN1.6
GPIO25: length 15.9
  Top Layer w0.17: U1.37 19.8,20.2 20.54,19.46 23.82,19.46 24.57,20.2 24.6,20.2 25.6,21.2 25.6,25.81 CN1.5
GPIO26_ADC0: length 16.3
  Top Layer w0.17: CN1.4 25.33,28.08 25.33,22.76 24.11,21.54 20.15,21.54 20,21.4 U1.40
GPIO27_ADC1: length 18.4
  Top Layer w0.17: U1.41 19.6,21.8 19.66,21.86 24,21.86 24.94,22.81 24.94,30.23 CN1.3
GPIO28_ADC2: length 20.6
  Top Layer w0.17: CN1.2 27.9,35.43 24.67,32.2 24.67,22.92 23.94,22.19 20.65,22.19 20.63,22.2 U1.42
GPIO29_ADC3: length 22.8
  Top Layer w0.17: U1.43 20.62,22.6 20.76,22.46 23.82,22.46 24.4,23.03 24.4,34.77 CN1.1
MISO: length 6.5
  Top Layer w0.254: U8.8 11,12.49 11,15.82 U1.16
MOSI: length 9.7
  Top Layer w0.254: U7.1 3.16,18.56 v1(3.2,18.6) ; U1.15 v1(8.2,17.8)
  Bottom Layer w0.254: v1(8.2,17.8) 7.4,18.6 v1(3.2,18.6)
QSPI_SCLK: length 10.4
  Top Layer w0.17: U2.6 10.71,32.96 12.04,31.63 12.04,26.76 13.8,25 U1.56
QSPI_SD0: length 8.8
  Top Layer w0.17: U2.5 10.33,28.02 13.38,24.97 13.38,24.2 U1.57
QSPI_SD1: length 17.9
  Top Layer w0.17: U2.2 2.6,34.23 1.8,33.44 1.8,31.4 3.18,30.02 7.22,30.02 12.6,24.65 U1.59
QSPI_SD2: length 13.8
  Top Layer w0.17: U1.58 13,24.85 4.88,32.96 U2.3
QSPI_SD3: length 12
  Top Layer w0.17: U1.55 14.2,25.03 12.4,26.83 12.4,32.8 10.97,34.23 U2.7
QSPI_SS: length 21
  Top Layer w0.17: U2.1 2.83,35.5 1.4,34.07 1.4,31.3 3.1,29.6 7.02,29.6 12.2,24.42 U1.60
  Top Layer w0.54: R11.2 3.27,37.4 U2.1
RUN: length 19.6
  Top Layer w0.17: CN1.15 27.9,2.81 19.2,11.51 19.2,13.4 18,14.6 17.2,14.6 16.2,15.6 U1.26
SCLK: length 6.4
  Top Layer w0.254: U7.8 9.04,18.56 9.4,18.2 U1.14
SWCLK: length 17.1
  Top Layer w0.18: U1.24 15.4,15 16.5,13.9 17.8,13.9 18.4,13.3 18.4,7.54 16.46,5.6 U9.3
SWDIO: length 17.2
  Top Layer w0.2: U1.25 15.8,15.4 17.01,14.19 17.92,14.19 18.8,13.31 18.8,7.4 21.54,4.66 U9.1
UCS: length 6.2
  Top Layer w0.254: U8.4 7.19,15.8 4,15.8 3.4,15.2 U4.22
UMISO: length 7.1
  Top Layer w0.254: U4.9 3.4,10.8 4.2,10 6.99,10 U8.5
UMOSI: length 2.4
  Top Layer w0.254: U4.24 2.6,15.15 2.05,15.7 U7.4
USB_DM: length 15.2
  Top Layer w0.254: 14.75,42.75 14.75,41.99 arc(14.85,41.74) 15.1,41.64 15.4,41.64 arc(15.65,41.74) 15.75,41.99 15.75,42.75
  Top Layer w0.6: 15.1,41.61 15.4,41.31 15.4,29.43
USB_DP: length 16.1
  Top Layer w0.254: USB1.B6 14.25,43.29 arc(14.3,43.46) 14.42,43.59 arc(14.51,43.63) 14.6,43.64 14.9,43.64 arc(15.15,43.53) 15.25,43.29 15.25,42.5
  Top Layer w0.3: USB1.B6 14.25,41.37
  Top Layer w0.6: 14.25,41.37 14.4,41.22 14.4,29.43
USCLK: length 3.6
  Top Layer w0.254: U7.5 4.24,17.04 3,15.8 U4.23
VREG_AVDD: length 5.8
  Top Layer w0.254: 18.54,24.17 U1.46 18.54,24.17 ; 18.54,24.17 R1.1 ; 18.54,24.17 C11.2
VREG_LX: length 4.1
  Top Layer w0.254: U1.48 17,27.3 L1.1
XIN: length 8.8
  Top Layer w0.254: U3.1 13.25,8.75 14.2,9.7 U1.21
XOUT: length 6.9
  Top Layer w0.254: 15.3,10.45 15.3,12.5 14.6,13.2 U1.22
$1N10163: length 4.9
  Top Layer w0.15: R5.1 15.4,28 14.97,27.57 14.97,25.58 15.8,24.75 U1.51
$1N10164: length 4.8
  Top Layer w0.15: U1.52 15.4,24.79 14.72,25.48 14.72,27.48 14.4,27.8 R4.1
$1N10214: length 1.6
  Top Layer w0.3: R2.1 USB1.A5
$1N10215: length 1.6
  Top Layer w0.3: R3.1 USB1.B5
$1N10260: length 1.8
  Top Layer w0.254: C19.1 4,10.8 3.8,11 3.8,11.97
$1N10297: length 1.4
  Top Layer w0.254: LED1.1 R6.2
$1N10303: length 1.4
  Top Layer w0.254: LED2.1 R7.2
$1N10309: length 1.4
  Top Layer w0.54: R8.2 LED3.1
$1N12330: length 1.4
  Top Layer w0.54: LED4.1 R9.2
$1N12589: length 1.4
  Top Layer w0.54: LED5.1 3.48,26.05 R10.2
$1N12752: length 16.1
  Top Layer w0.54: R11.1 v1(5,37.4)
  Bottom Layer w0.254: v1(5,37.4) 7.02,35.38 v1(19.4,35.38)

## Copper pours and planes (outline as drawn; the poured copper is in the pictures)
+1V1 on Top Layer: 12.8,22.8 17.2,22.8 17.2,18.4 12.8,18.4
+1V8 on Top Layer: 5.4,21.8 5.4,10.3 1.08,10.3 1.08,21.8
+3V3 on Top Layer: 11.4,24.2 18.6,24.2 18.6,17 11.4,17
+3V3 on Top Layer: -2.4,52 31.8,52 31.8,-1.4 -2.4,-1.4
+3V3 on Top Layer: 11.4,24.2 18.6,24.2 18.6,17 11.4,17
GND on Top Layer: 11.4,13 17.6,13 17.6,7.4 11.4,7.4
GND on Top Layer: 17.4,26.76 18.81,26.76 18.81,25.15 17.4,25.15
GND on Top Layer: 11.8,42.64 17.55,42.64 17.55,29.04 11.8,29.04
GND on Bottom Layer: -4.6,50.8 32.8,50.8 32.8,-3 -4.6,-3
VBUS on Top Layer: 23.3,42.1 23.3,47.9 6.6,47.9 6.6,42.1

Small or netless copper shapes (teardrops, artwork), in the pictures only: 205 on Top Layer, 10 on Bottom Layer

## Text on the board
Bottom Silkscreen Layer: んﾑᄃズ ᄃﾚひ乃乃乇尺 - Jaydev Parmar
Top Silkscreen Layer: GP1 | GP0 | 3v3 | GND | CLK | IO | D24 | D25 | D23 | D22 | D20 | RUN | D21 | D18 | D17 | D19 | D16 | A3 | A2 | A0 | A1
